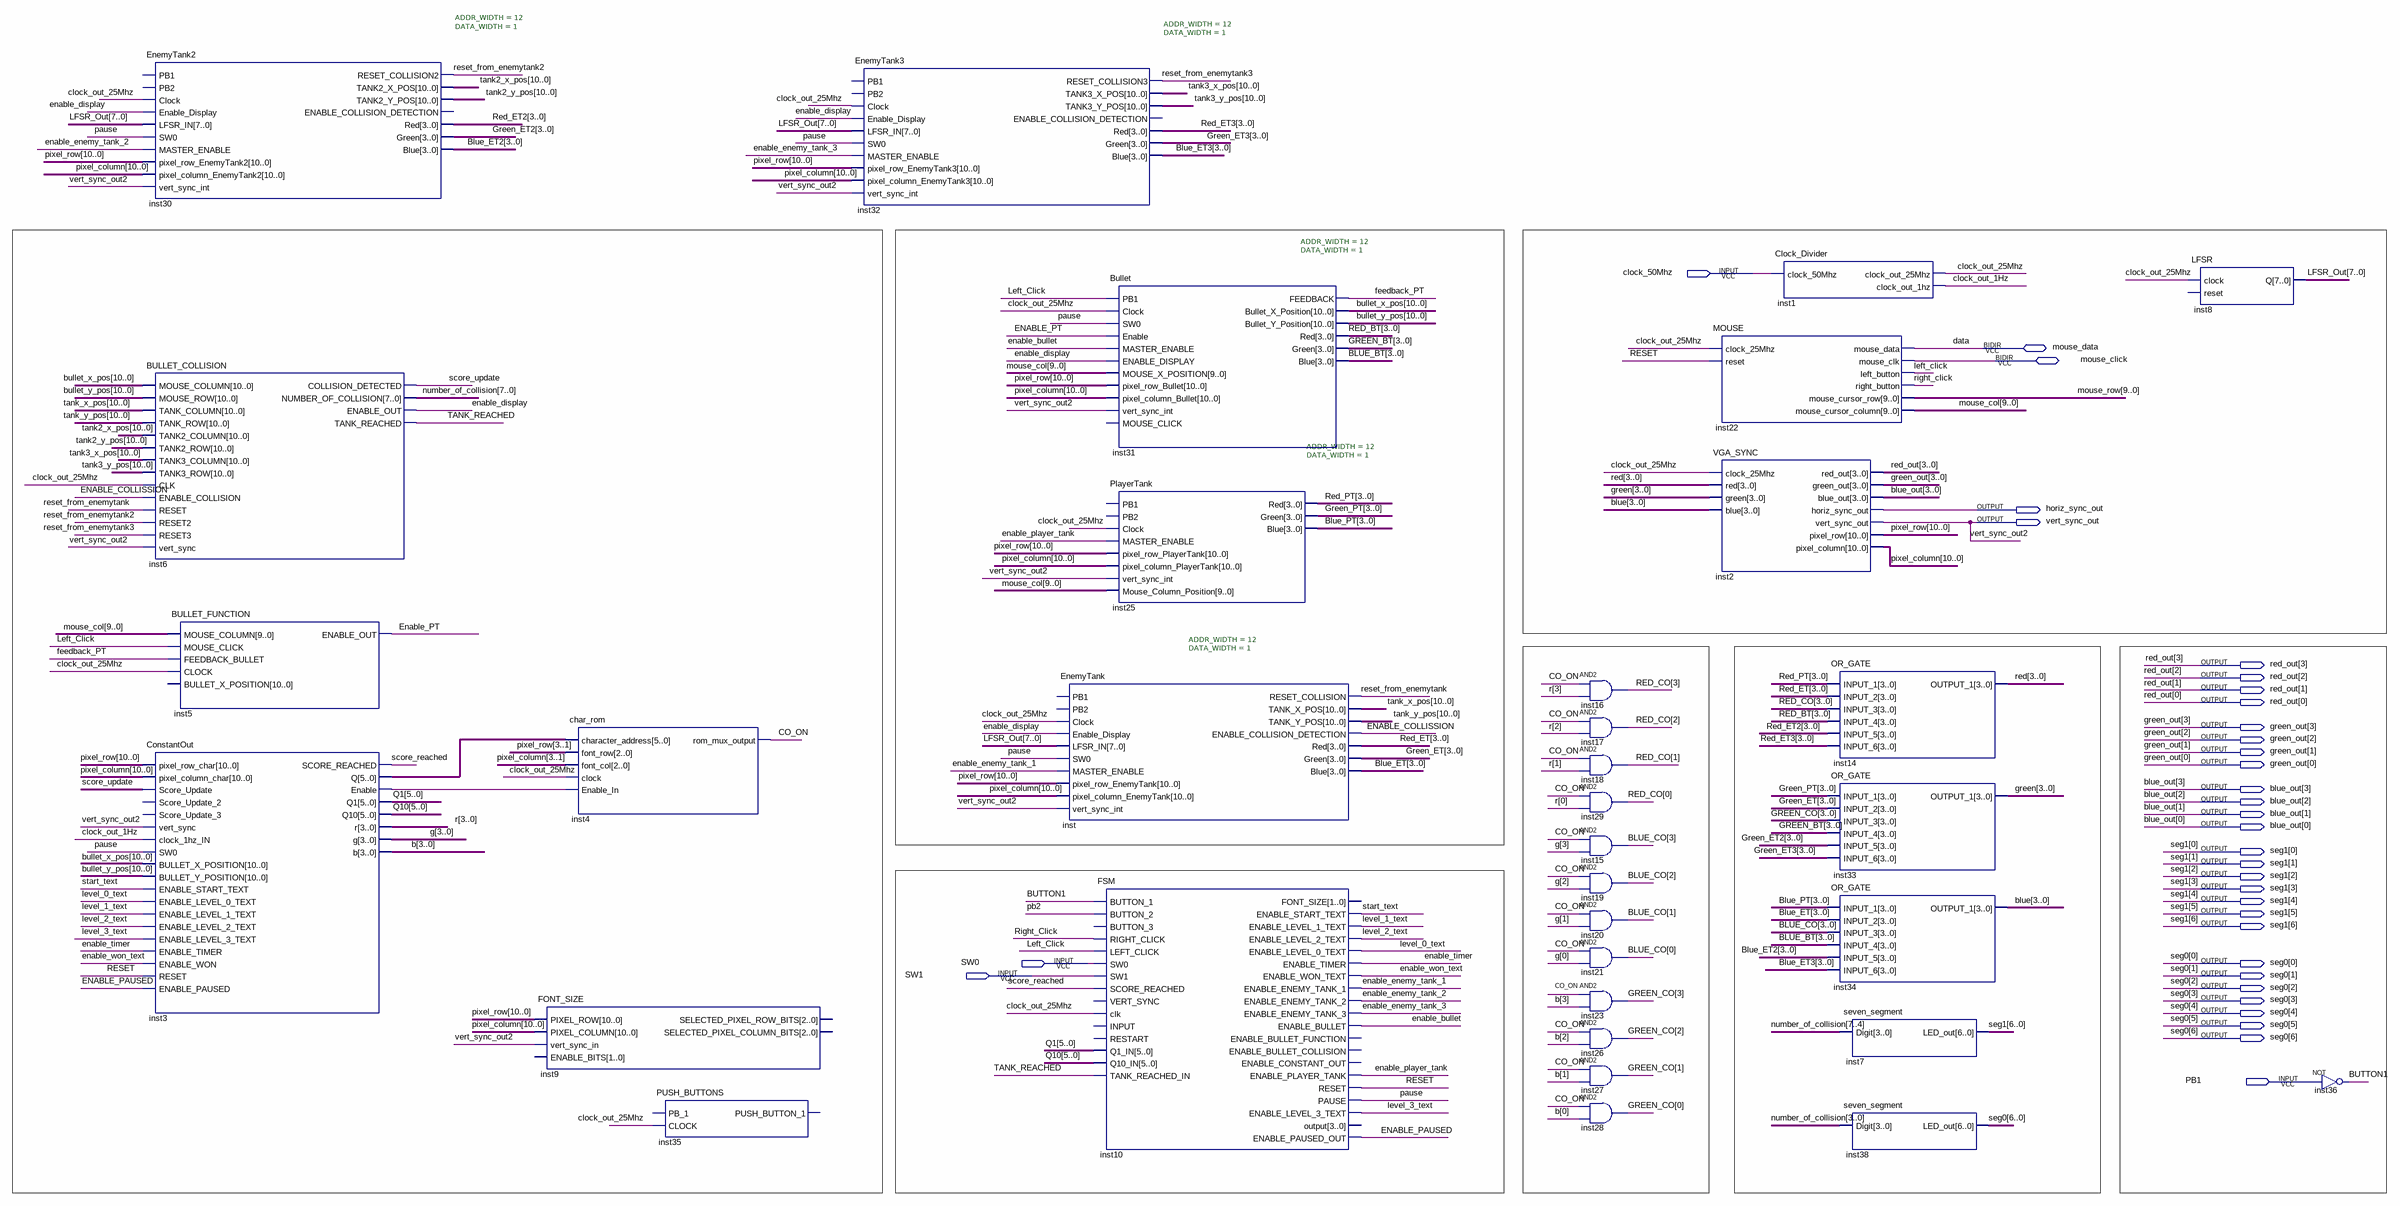
[diagram p0: schematic sheet]
// Quartus schematic Block1.bdf as structural Verilog: 34 symbols, 34 pins
module Block1 (
  input  clock_50Mhz,
  input  SW0,
  input  SW1,
  input  PB1,
  inout  mouse_data,
  inout  mouse_click,
  output horiz_sync_out,
  output vert_sync_out,
  output [3:0] red_out,
  output [3:0] green_out,
  output [3:0] blue_out,
  output [6:0] seg1,
  output [6:0] seg0
);

  wire BUTTON1, clock_out_1Hz, clock_out_25Mhz, CO_ON, enable_bullet, ENABLE_COLLISSION, enable_display,
       enable_enemy_tank_1, enable_enemy_tank_2, enable_enemy_tank_3, ENABLE_PAUSED, enable_player_tank,
       ENABLE_PT, enable_timer, enable_won_text, feedback_PT, inst3_enable, Left_Click, level_0_text,
       level_1_text, level_2_text, level_3_text, pause, pb2, RESET, reset_from_enemytank,
       reset_from_enemytank2, reset_from_enemytank3, Right_Click, score_reached, score_update, start_text,
       TANK_REACHED;
  wire [3:0] b, blue, BLUE_BT, BLUE_CO, Blue_ET, Blue_ET2, Blue_ET3, Blue_PT, g, green, GREEN_BT, GREEN_CO,
       Green_ET, Green_ET2, Green_ET3, Green_PT, r, red, RED_BT, RED_CO, Red_ET, Red_ET2, Red_ET3, Red_PT;
  wire [5:0] inst3_q, Q1, Q10;
  wire [7:0] LFSR_Out, number_of_collision;
  wire [9:0] mouse_col, mouse_row;
  wire [10:0] bullet_x_pos, bullet_y_pos, pixel_column, pixel_row, tank2_x_pos, tank2_y_pos, tank3_x_pos,
       tank3_y_pos, tank_x_pos, tank_y_pos;

  EnemyTank2 #(.ADDR_WIDTH(12), .DATA_WIDTH(1)) inst30 (
    .Clock(clock_out_25Mhz), .Enable_Display(enable_display), .LFSR_IN(LFSR_Out), .SW0(pause),
    .MASTER_ENABLE(enable_enemy_tank_2), .pixel_row_EnemyTank2(pixel_row),
    .pixel_column_EnemyTank2(pixel_column), .vert_sync_int(vert_sync_out),
    .RESET_COLLISION2(reset_from_enemytank2), .TANK2_X_POS(tank2_x_pos), .TANK2_Y_POS(tank2_y_pos),
    .Red(Red_ET2), .Green(Green_ET2), .Blue(Blue_ET2));  // open: PB1, PB2, ENABLE_COLLISION_DETECTION
  BULLET_COLLISION inst6 (
    .MOUSE_COLUMN(bullet_x_pos), .MOUSE_ROW(bullet_y_pos), .TANK_COLUMN(tank_x_pos), .TANK_ROW(tank_y_pos),
    .TANK2_COLUMN(tank2_x_pos), .TANK2_ROW(tank2_y_pos), .TANK3_COLUMN(tank3_x_pos), .TANK3_ROW(tank3_y_pos),
    .CLK(clock_out_25Mhz), .ENABLE_COLLISION(ENABLE_COLLISSION), .RESET(reset_from_enemytank),
    .RESET2(reset_from_enemytank2), .RESET3(reset_from_enemytank3), .vert_sync(vert_sync_out),
    .COLLISION_DETECTED(score_update), .NUMBER_OF_COLLISION(number_of_collision),
    .ENABLE_OUT(enable_display), .TANK_REACHED(TANK_REACHED));
  ConstantOut inst3 (
    .pixel_row_char(pixel_row), .pixel_column_char(pixel_column), .Score_Update(score_update),
    .vert_sync(vert_sync_out), .clock_1hz_IN(clock_out_1Hz), .SW0(pause), .BULLET_X_POSITION(bullet_x_pos),
    .BULLET_Y_POSITION(bullet_y_pos), .ENABLE_START_TEXT(start_text), .ENABLE_LEVEL_0_TEXT(level_0_text),
    .ENABLE_LEVEL_1_TEXT(level_1_text), .ENABLE_LEVEL_2_TEXT(level_2_text),
    .ENABLE_LEVEL_3_TEXT(level_3_text), .ENABLE_TIMER(enable_timer), .ENABLE_WON(enable_won_text),
    .RESET(RESET), .ENABLE_PAUSED(ENABLE_PAUSED), .SCORE_REACHED(score_reached), .Q(inst3_q),
    .Enable(inst3_enable), .Q1(Q1), .Q10(Q10), .r(r), .g(g), .b(b));  // open: Score_Update_2, Score_Update_3
  BULLET_FUNCTION inst5 (
    .MOUSE_COLUMN(mouse_col), .MOUSE_CLICK(Left_Click), .FEEDBACK_BULLET(feedback_PT),
    .CLOCK(clock_out_25Mhz), .ENABLE_OUT(ENABLE_PT));  // open: BULLET_X_POSITION
  FONT_SIZE inst9 (
    .PIXEL_ROW(pixel_row), .PIXEL_COLUMN(pixel_column), .vert_sync_in(vert_sync_out));  // open: ENABLE_BITS, SELECTED_PIXEL_ROW_BITS, SELECTED_PIXEL_COLUMN_BITS
  char_rom inst4 (
    .character_address(inst3_q), .font_row(pixel_row[3:1]), .font_col(pixel_column[3:1]),
    .clock(clock_out_25Mhz), .Enable_In(inst3_enable), .rom_mux_output(CO_ON));
  PUSH_BUTTONS inst35 (.CLOCK(clock_out_25Mhz));  // open: PB_1, PUSH_BUTTON_1
  EnemyTank3 #(.ADDR_WIDTH(12), .DATA_WIDTH(1)) inst32 (
    .Clock(clock_out_25Mhz), .Enable_Display(enable_display), .LFSR_IN(LFSR_Out), .SW0(pause),
    .MASTER_ENABLE(enable_enemy_tank_3), .pixel_row_EnemyTank3(pixel_row),
    .pixel_column_EnemyTank3(pixel_column), .vert_sync_int(vert_sync_out),
    .RESET_COLLISION3(reset_from_enemytank3), .TANK3_X_POS(tank3_x_pos), .TANK3_Y_POS(tank3_y_pos),
    .Red(Red_ET3), .Green(Green_ET3), .Blue(Blue_ET3));  // open: PB1, PB2, ENABLE_COLLISION_DETECTION
  EnemyTank #(.ADDR_WIDTH(12), .DATA_WIDTH(1)) inst (
    .Clock(clock_out_25Mhz), .Enable_Display(enable_display), .LFSR_IN(LFSR_Out), .SW0(pause),
    .MASTER_ENABLE(enable_enemy_tank_1), .pixel_row_EnemyTank(pixel_row),
    .pixel_column_EnemyTank(pixel_column), .vert_sync_int(vert_sync_out),
    .RESET_COLLISION(reset_from_enemytank), .TANK_X_POS(tank_x_pos), .TANK_Y_POS(tank_y_pos),
    .ENABLE_COLLISION_DETECTION(ENABLE_COLLISSION), .Red(Red_ET), .Green(Green_ET), .Blue(Blue_ET));  // open: PB1, PB2
  Bullet #(.ADDR_WIDTH(12), .DATA_WIDTH(1)) inst31 (
    .PB1(Left_Click), .Clock(clock_out_25Mhz), .SW0(pause), .Enable(ENABLE_PT),
    .MASTER_ENABLE(enable_bullet), .ENABLE_DISPLAY(enable_display), .MOUSE_X_POSITION(mouse_col),
    .pixel_row_Bullet(pixel_row), .pixel_column_Bullet(pixel_column), .vert_sync_int(vert_sync_out),
    .FEEDBACK(feedback_PT), .Bullet_X_Position(bullet_x_pos), .Bullet_Y_Position(bullet_y_pos), .Red(RED_BT),
    .Green(GREEN_BT), .Blue(BLUE_BT));  // open: MOUSE_CLICK
  PlayerTank #(.ADDR_WIDTH(12), .DATA_WIDTH(1)) inst25 (
    .Clock(clock_out_25Mhz), .MASTER_ENABLE(enable_player_tank), .pixel_row_PlayerTank(pixel_row),
    .pixel_column_PlayerTank(pixel_column), .vert_sync_int(vert_sync_out), .Mouse_Column_Position(mouse_col),
    .Red(Red_PT), .Green(Green_PT), .Blue(Blue_PT));  // open: PB1, PB2
  FSM inst10 (
    .BUTTON_1(BUTTON1), .BUTTON_2(pb2), .RIGHT_CLICK(Right_Click), .LEFT_CLICK(Left_Click), .SW0(SW0),
    .SW1(SW1), .SCORE_REACHED(score_reached), .clk(clock_out_25Mhz), .Q1_IN(Q1), .Q10_IN(Q10),
    .TANK_REACHED_IN(TANK_REACHED), .ENABLE_START_TEXT(start_text), .ENABLE_LEVEL_1_TEXT(level_1_text),
    .ENABLE_LEVEL_2_TEXT(level_2_text), .ENABLE_LEVEL_0_TEXT(level_0_text), .ENABLE_TIMER(enable_timer),
    .ENABLE_WON_TEXT(enable_won_text), .ENABLE_ENEMY_TANK_1(enable_enemy_tank_1),
    .ENABLE_ENEMY_TANK_2(enable_enemy_tank_2), .ENABLE_ENEMY_TANK_3(enable_enemy_tank_3),
    .ENABLE_BULLET(enable_bullet), .ENABLE_PLAYER_TANK(enable_player_tank), .RESET(RESET), .PAUSE(pause),
    .ENABLE_LEVEL_3_TEXT(level_3_text), .ENABLE_PAUSED_OUT(ENABLE_PAUSED));  // open: BUTTON_3, VERT_SYNC, INPUT, RESTART, FONT_SIZE, ENABLE_BULLET_FUNCTION, ENABLE_BULLET_COLLISION, ENABLE_CONSTANT_OUT, output
  and inst16 (RED_CO[3], CO_ON, r[3]);
  and inst17 (RED_CO[2], CO_ON, r[2]);
  and inst18 (RED_CO[1], CO_ON, r[1]);
  and inst29 (RED_CO[0], CO_ON, r[0]);
  and inst15 (BLUE_CO[3], CO_ON, g[3]);
  and inst19 (BLUE_CO[2], CO_ON, g[2]);
  and inst20 (BLUE_CO[1], CO_ON, g[1]);
  and inst21 (BLUE_CO[0], CO_ON, g[0]);
  and inst23 (GREEN_CO[3], CO_ON, b[3]);
  and inst26 (GREEN_CO[2], CO_ON, b[2]);
  and inst27 (GREEN_CO[1], CO_ON, b[1]);
  and inst28 (GREEN_CO[0], CO_ON, b[0]);
  MOUSE inst22 (
    .clock_25Mhz(clock_out_25Mhz), .reset(RESET), .left_button(Left_Click), .right_button(Right_Click),
    .mouse_cursor_row(mouse_row), .mouse_cursor_column(mouse_col), .mouse_data(mouse_data),
    .mouse_clk(mouse_click));
  VGA_SYNC inst2 (
    .clock_25Mhz(clock_out_25Mhz), .red(red), .green(green), .blue(blue), .red_out(red_out),
    .green_out(green_out), .blue_out(blue_out), .horiz_sync_out(horiz_sync_out),
    .vert_sync_out(vert_sync_out), .pixel_row(pixel_row), .pixel_column(pixel_column));
  Clock_Divider inst1 (.clock_50Mhz(clock_50Mhz), .clock_out_25Mhz(clock_out_25Mhz), .clock_out_1hz(clock_out_1Hz));
  OR_GATE inst14 (
    .INPUT_1(Red_PT), .INPUT_2(Red_ET), .INPUT_3(RED_CO), .INPUT_4(RED_BT), .INPUT_5(Red_ET2),
    .INPUT_6(Red_ET3), .OUTPUT_1(red));
  OR_GATE inst33 (
    .INPUT_1(Green_PT), .INPUT_2(Green_ET), .INPUT_3(GREEN_CO), .INPUT_4(GREEN_BT), .INPUT_5(Green_ET2),
    .INPUT_6(Green_ET3), .OUTPUT_1(green));
  OR_GATE inst34 (
    .INPUT_1(Blue_PT), .INPUT_2(Blue_ET), .INPUT_3(BLUE_CO), .INPUT_4(BLUE_BT), .INPUT_5(Blue_ET2),
    .INPUT_6(Blue_ET3), .OUTPUT_1(blue));
  seven_segment inst7 (.Digit(number_of_collision[7:4]), .LED_out(seg1));
  seven_segment inst38 (.Digit(number_of_collision[3:0]), .LED_out(seg0));
  LFSR inst8 (.clock(clock_out_25Mhz), .Q(LFSR_Out));  // open: reset
  not inst36 (BUTTON1, PB1);

  // Other names for the same wires on the sheet: data = mouse_data; vert_sync_out2 = vert_sync_out
endmodule
